# EAGLE design routedShield (EAGLE 8.7.1)
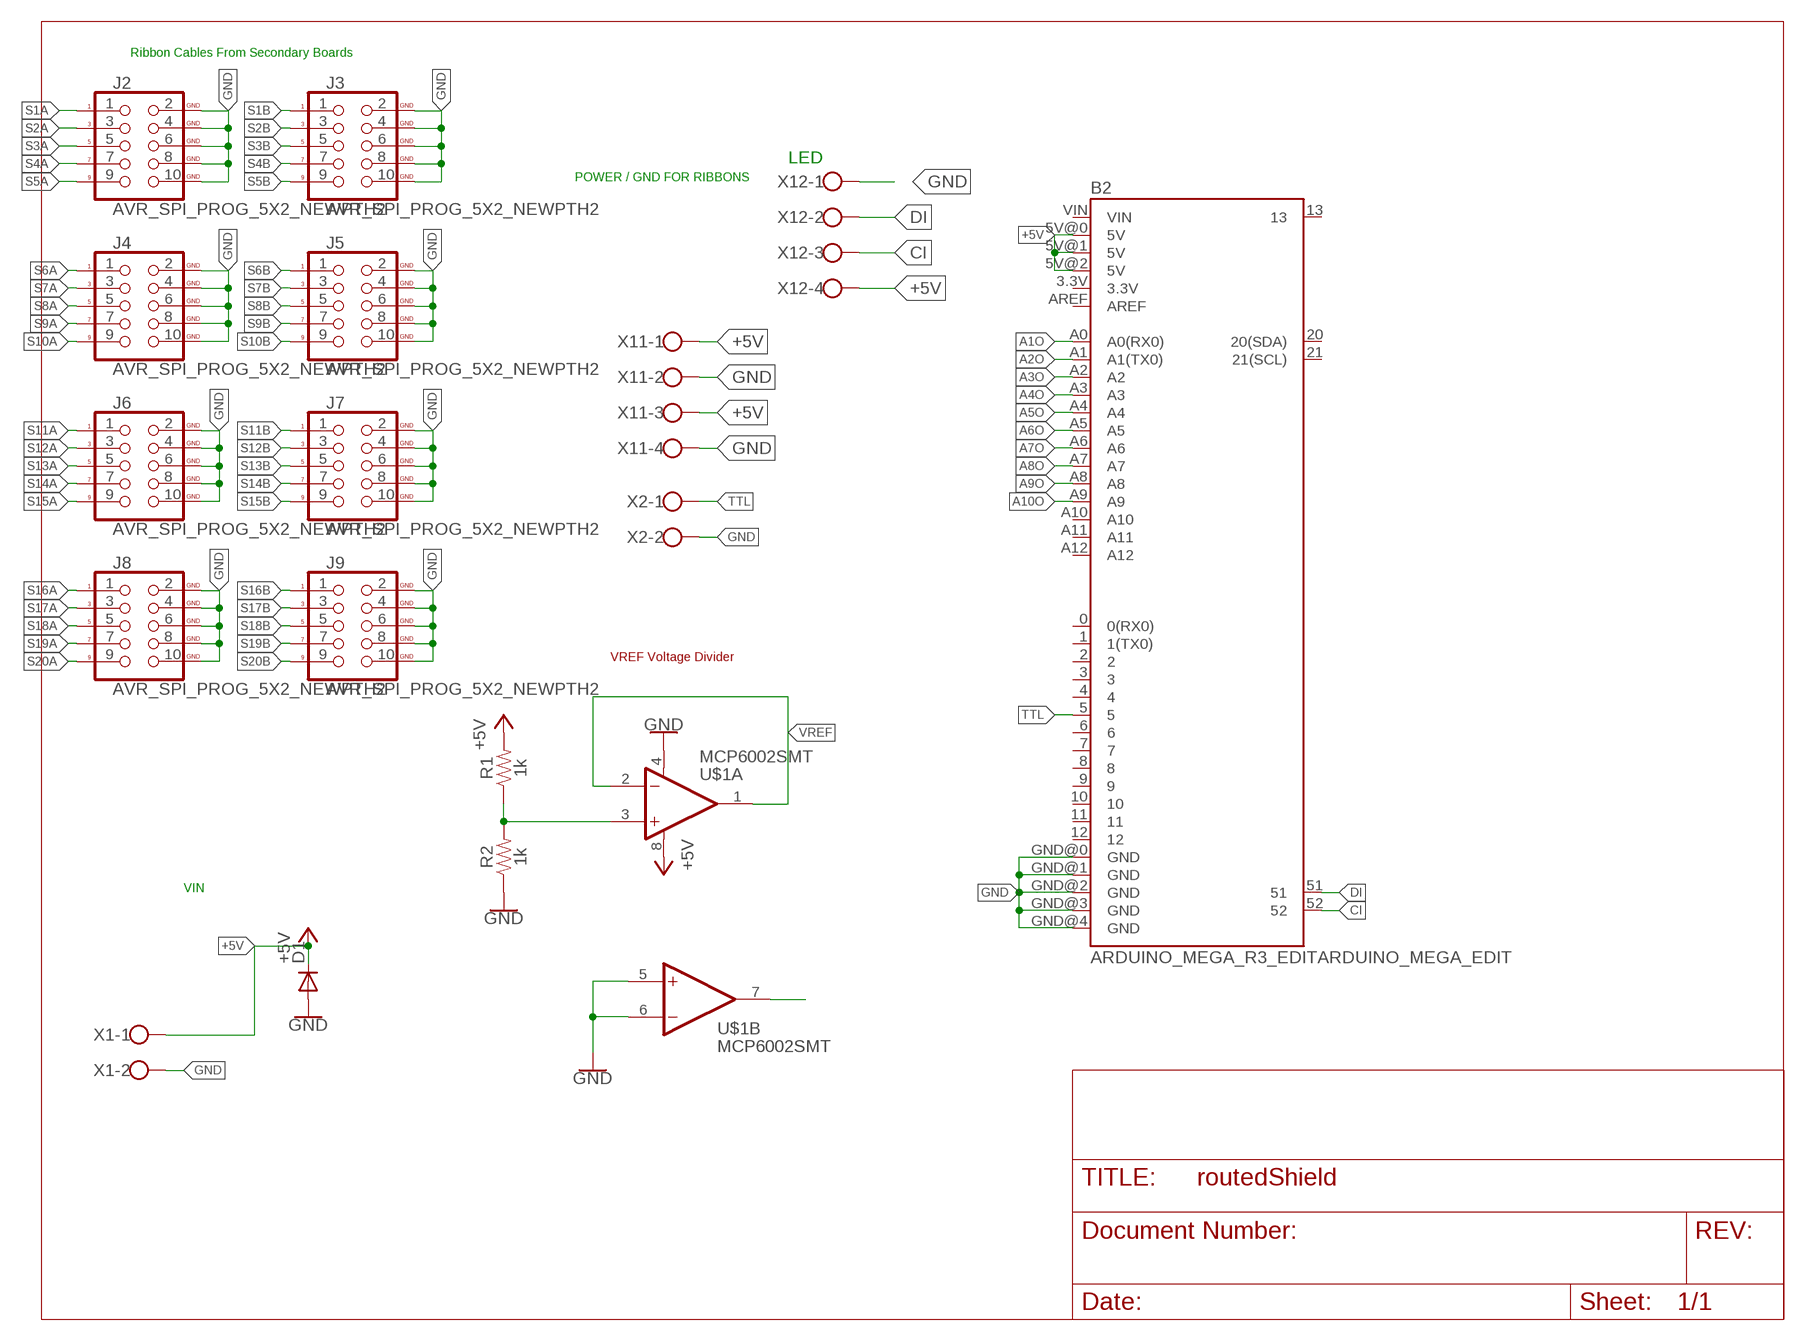
[diagram p0: schematic, sheet 1, part 1 of 2]
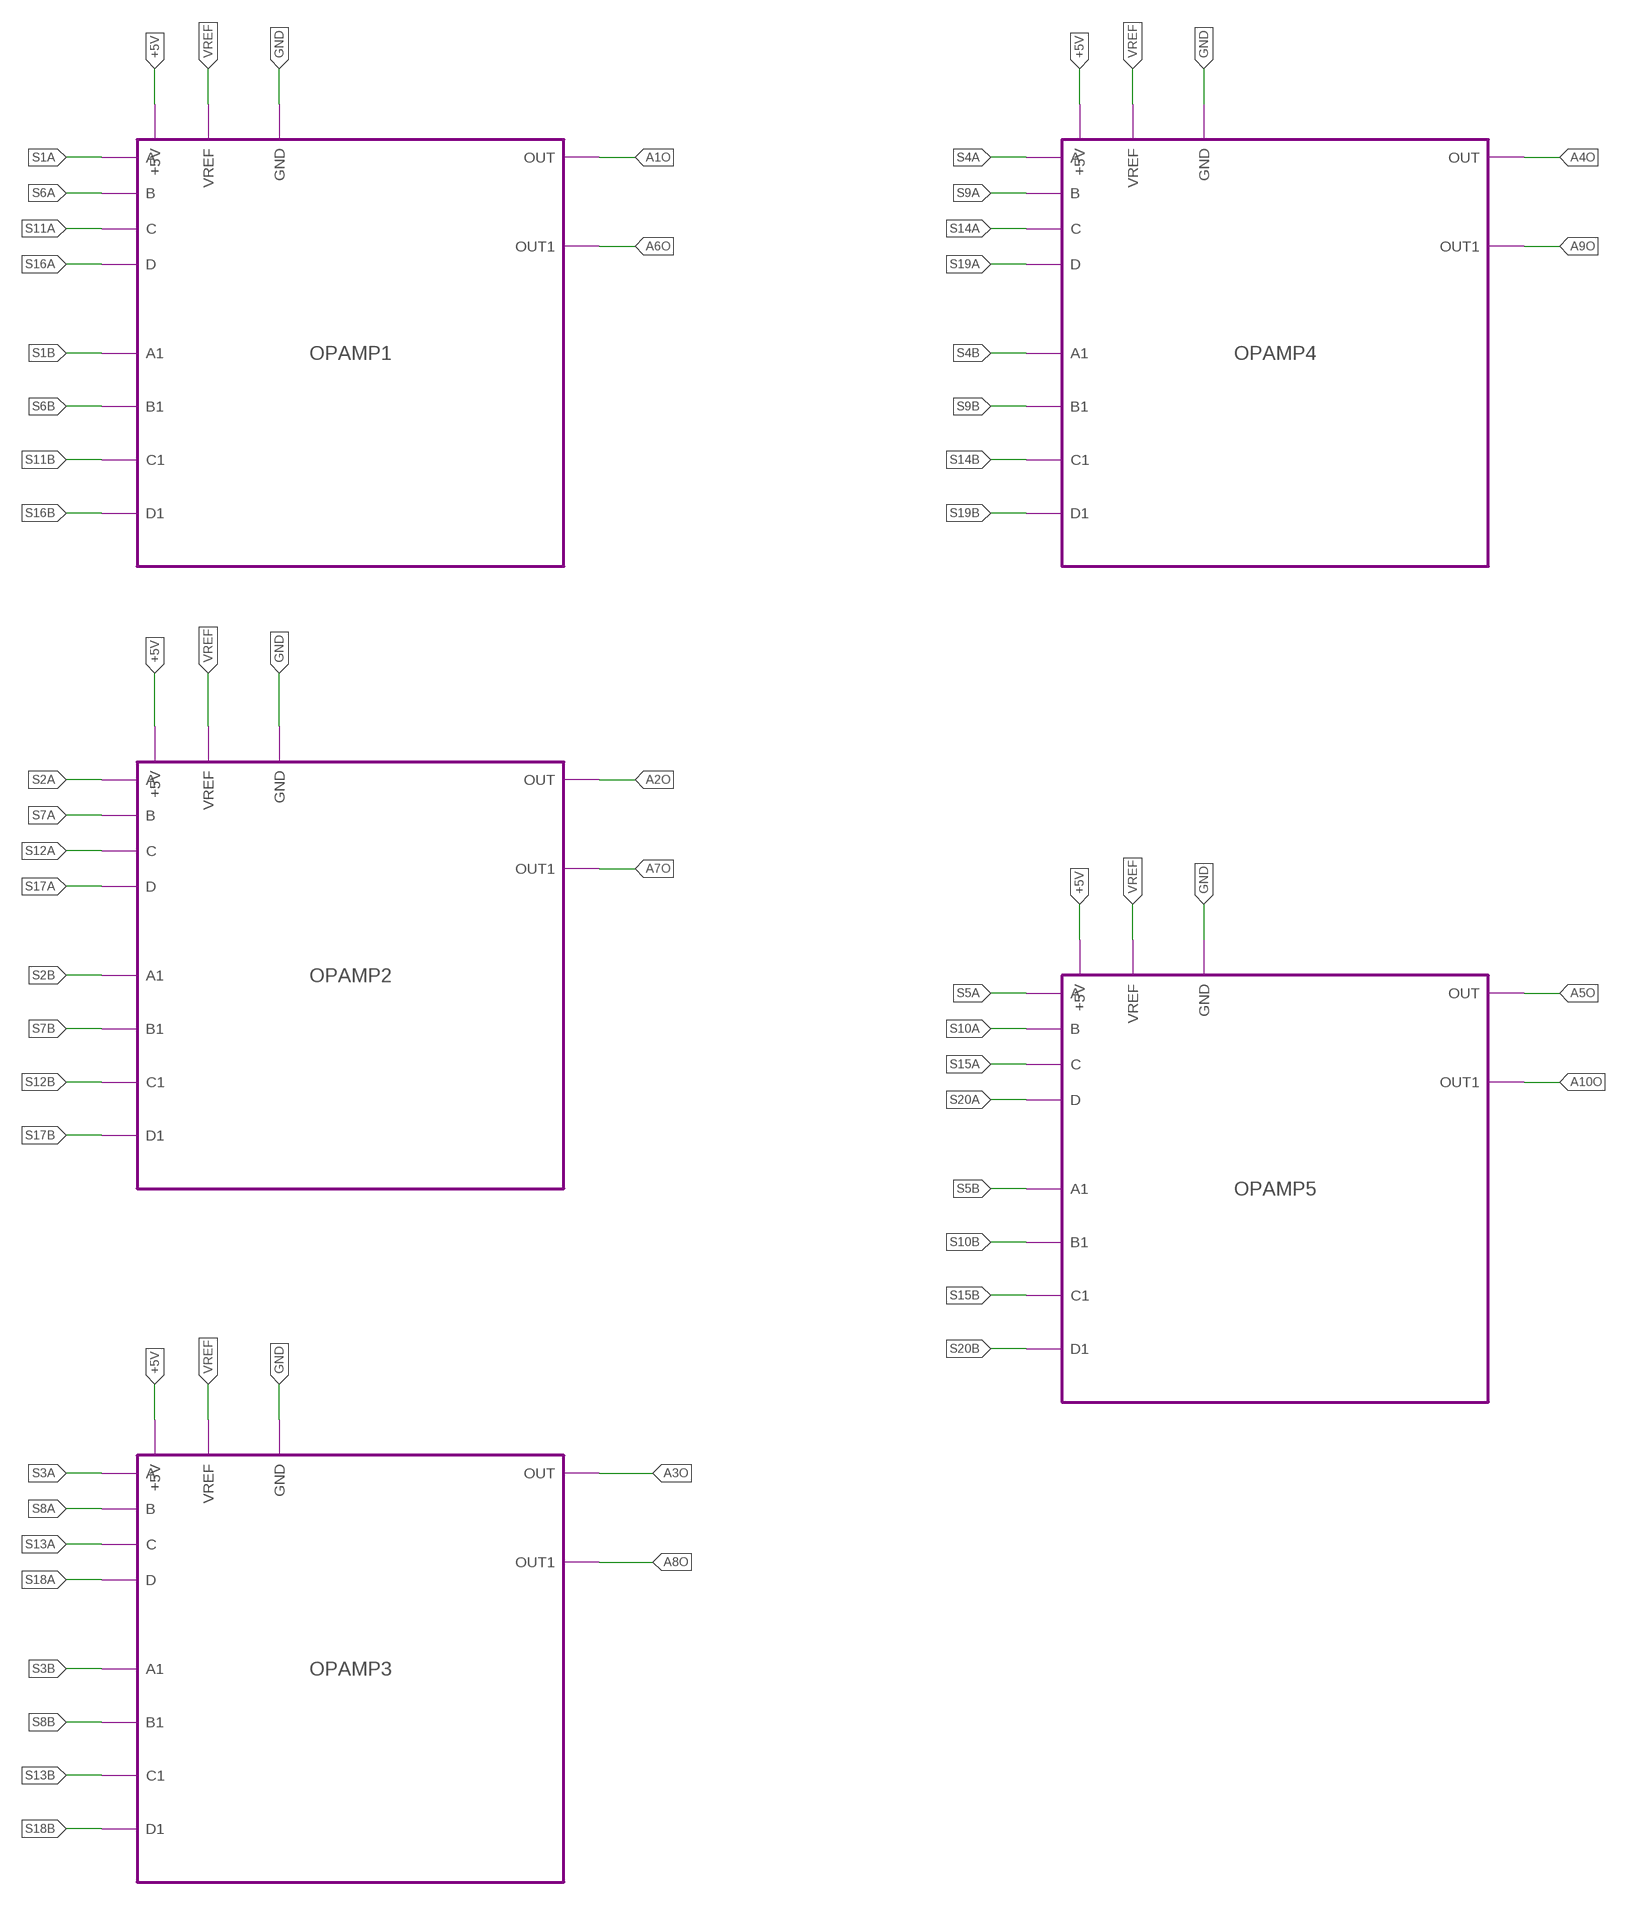
[diagram p1: schematic, sheet 1, part 2 of 2]

## Parts
B2  ARDUINO_MEGA_R3_EDITARDUINO_MEGA_EDIT  [ARDUINO_MEGA_EDIT]
D1  DIODE-DO-214AC  [DO-214AC]
J2  AVR_SPI_PROG_5X2_NEWPTH2  [2X5-SHROUDED]
J3  AVR_SPI_PROG_5X2_NEWPTH2  [2X5-SHROUDED]
J4  AVR_SPI_PROG_5X2_NEWPTH2  [2X5-SHROUDED]
J5  AVR_SPI_PROG_5X2_NEWPTH2  [2X5-SHROUDED]
J6  AVR_SPI_PROG_5X2_NEWPTH2  [2X5-SHROUDED]
J7  AVR_SPI_PROG_5X2_NEWPTH2  [2X5-SHROUDED]
J8  AVR_SPI_PROG_5X2_NEWPTH2  [2X5-SHROUDED]
J9  AVR_SPI_PROG_5X2_NEWPTH2  [2X5-SHROUDED]
R1  1k  RESISTOR0805  [0805]
R2  1k  RESISTOR0805  [0805]
U$1  MCP6002SMT  [SOIC8]
X1  W237-102  [W237-102]
X2  W237-102  [W237-102]
X11  W237-4  [W237-4]
X12  W237-4  [W237-4]

## Module instances
OPAMP1 = OPAMP
OPAMP2 = OPAMP
OPAMP3 = OPAMP
OPAMP4 = OPAMP
OPAMP5 = OPAMP

## Nets
+5V: B2.5V@0(5V) B2.5V@1(5V) B2.5V@2(5V) D1.C R1.2 U$1.8(A:V+) X1.1 X11.1 X11.3 X12.4 ; port OPAMP3.+5V OPAMP4.+5V OPAMP5.+5V OPAMP1.+5V OPAMP2.+5V
A1O: B2.A0(A0(RX0)) ; port OPAMP1.OUT
A2O: B2.A1(A1(TX0)) ; port OPAMP2.OUT
A3O: B2.A2 ; port OPAMP3.OUT
A4O: B2.A3 ; port OPAMP4.OUT
A5O: B2.A4 ; port OPAMP5.OUT
A6O: B2.A5 ; port OPAMP1.OUT1
A7O: B2.A6 ; port OPAMP2.OUT1
A8O: B2.A7 ; port OPAMP3.OUT1
A9O: B2.A8 ; port OPAMP4.OUT1
A10O: B2.A9 ; port OPAMP5.OUT1
CI: B2.52 X12.3
DI: B2.51 X12.2
GND: B2.GND@0(GND) B2.GND@1(GND) B2.GND@2(GND) B2.GND@3(GND) B2.GND@4(GND) D1.A J2.2(GND) J2.4(GND) J2.6(GND) J2.8(GND) J2.10(GND) J3.2(GND) J3.4(GND) J3.6(GND) J3.8(GND) J3.10(GND) J4.2(GND) J4.4(GND) J4.6(GND) J4.8(GND) J4.10(GND) J5.2(GND) J5.4(GND) J5.6(GND) J5.8(GND) J5.10(GND) J6.2(GND) J6.4(GND) J6.6(GND) J6.8(GND) J6.10(GND) J7.2(GND) J7.4(GND) J7.6(GND) J7.8(GND) J7.10(GND) J8.2(GND) J8.4(GND) J8.6(GND) J8.8(GND) J8.10(GND) J9.2(GND) J9.4(GND) J9.6(GND) J9.8(GND) J9.10(GND) R2.1 U$1.4(A:V-) U$1.5(B:+IN) U$1.6(B:-IN) X1.2 X2.2 X11.2 X11.4 X12.1 ; port OPAMP2.GND OPAMP3.GND OPAMP4.GND OPAMP5.GND OPAMP1.GND
N$1: U$1.7(B:OUT)
N$2: R1.1 R2.2 U$1.3(A:+IN)
S1A: J2.1 ; port OPAMP1.A
S1B: J3.1 ; port OPAMP1.A1
S2A: J2.3 ; port OPAMP2.A
S2B: J3.3 ; port OPAMP2.A1
S3A: J2.5 ; port OPAMP3.A
S3B: J3.5 ; port OPAMP3.A1
S4A: J2.7 ; port OPAMP4.A
S4B: J3.7 ; port OPAMP4.A1
S5A: J2.9 ; port OPAMP5.A
S5B: J3.9 ; port OPAMP5.A1
S6A: J4.1 ; port OPAMP1.B
S6B: J5.1 ; port OPAMP1.B1
S7A: J4.3 ; port OPAMP2.B
S7B: J5.3 ; port OPAMP2.B1
S8A: J4.5 ; port OPAMP3.B
S8B: J5.5 ; port OPAMP3.B1
S9A: J4.7 ; port OPAMP4.B
S9B: J5.7 ; port OPAMP4.B1
S10A: J4.9 ; port OPAMP5.B
S10B: J5.9 ; port OPAMP5.B1
S11A: J6.1 ; port OPAMP1.C
S11B: J7.1 ; port OPAMP1.C1
S12A: J6.3 ; port OPAMP2.C
S12B: J7.3 ; port OPAMP2.C1
S13A: J6.5 ; port OPAMP3.C
S13B: J7.5 ; port OPAMP3.C1
S14A: J6.7 ; port OPAMP4.C
S14B: J7.7 ; port OPAMP4.C1
S15A: J6.9 ; port OPAMP5.C
S15B: J7.9 ; port OPAMP5.C1
S16A: J8.1 ; port OPAMP1.D
S16B: J9.1 ; port OPAMP1.D1
S17A: J8.3 ; port OPAMP2.D
S17B: J9.3 ; port OPAMP2.D1
S18A: J8.5 ; port OPAMP3.D
S18B: J9.5 ; port OPAMP3.D1
S19A: J8.7 ; port OPAMP4.D
S19B: J9.7 ; port OPAMP4.D1
S20A: J8.9 ; port OPAMP5.D
S20B: J9.9 ; port OPAMP5.D1
TTL: B2.5 X2.1
VREF: U$1.1(A:OUT) U$1.2(A:-IN) ; port OPAMP2.VREF OPAMP3.VREF OPAMP4.VREF OPAMP5.VREF OPAMP1.VREF
Unconnected: B2.0(0(RX0)) B2.1(1(TX0)) B2.2 B2.3 B2.3.3V B2.4 B2.6 B2.7 B2.8 B2.9 B2.10 B2.11 B2.12 B2.13 B2.20(20(SDA)) B2.21(21(SCL)) B2.A10 B2.A11 B2.A12 B2.AREF B2.VIN

## Notes on the sheet
- Ribbon Cables From Secondary Boards
- LED
- POWER / GND FOR RIBBONS
- VREF Voltage Divider
- VIN

## Library data of the parts
B2 = SparkFun-Boards:ARDUINO_MEGA_R3_EDIT: Arduino Mega R3 ATmega2560 R3 compatible footprint. SparkFun Products: Arduino Mega 2560 R3 <https://www.sparkfun.com/products/11061>
D1 = diode:DIODE-: DIODE
J2-J9 = SparkFun-Connectors:AVR_SPI_PROG_5X2_NEW: AVR 10-pin ICSP Header This is the standard AVR In Circuit Serial Programming header. Minimal, but includes pin one indicator. Works with standard Olimex programmers. SparkFun Products: 2x5 AVR ICSP Male Header <https://www.sparkfun.com/products/778> - PTH 2x5 Pin Shrouded Header <https://www.sparkfun.com/products/8506> - PTH2; PROD_ID: CONN-08671; SF_ID: PRT-08506
R1 R2 = SparkFun-Resistors:RESISTOR: Generic Resistor Package
U$1 = adam - ics:MCP6002: Dual General Op Amp 1.8V min supply 1MHz (6V/us)
X1 X2 = con-wago-500:W237-102: WAGO SCREW CLAMP; MPN: 237-102; OC_FARNELL: unknown; OC_NEWARK: 70K9898
X11 X12 = con-wago-500:W237-4: WAGO SCREW CLAMP; OC_FARNELL: unknown; OC_NEWARK: unknown

## Module OPAMP
Ports: A(in) B(in) C(in) D(in) A1(in) B1(in) C1(in) D1(in) +5V(pwr) VREF(pwr) GND(pwr) OUT(out) OUT1(out)
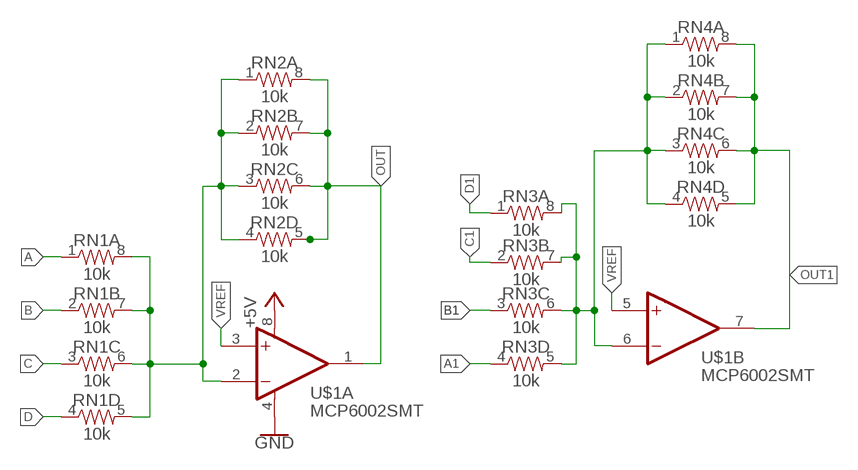
[diagram p2: schematic, module OPAMP, sheet 1]

### Parts
RN1  10k  1KOHM-ARRAY(4)0805-ARV-EDIT10K  [0805-ARV_EDIT10K]
RN2  10k  1KOHM-ARRAY(4)0805-ARV-EDIT10K  [0805-ARV_EDIT10K]
RN3  10k  1KOHM-ARRAY(4)0805-ARV-EDIT10K  [0805-ARV_EDIT10K]
RN4  10k  1KOHM-ARRAY(4)0805-ARV-EDIT10K  [0805-ARV_EDIT10K]
U$1  MCP6002SMT  [SOIC8]

### Nets
+5V: U$1.8(A:V+)
A: RN1.1
A1: RN3.4
B: RN1.2
B1: RN3.3
C: RN1.3
C1: RN3.2
D: RN1.4
D1: RN3.1
GND: U$1.4(A:V-)
N$1: RN3.5 RN3.6 RN3.7 RN3.8 RN4.1 RN4.2 RN4.3 RN4.4 U$1.6(B:-IN)
N$2: RN1.5 RN1.6 RN1.7 RN1.8 RN2.1 RN2.2 RN2.3 RN2.4 U$1.2(A:-IN)
OUT: RN2.5 RN2.6 RN2.7 RN2.8 U$1.1(A:OUT)
OUT1: RN4.5 RN4.6 RN4.7 RN4.8 U$1.7(B:OUT)
VREF: U$1.3(A:+IN) U$1.5(B:+IN)

### Library data of the parts
RN1-RN4 = SparkFun-Resistors:1KOHM-ARRAY(4): 4 x 1kΩ resistor array A resistor is a passive two-terminal electrical component that implements electrical resistance as a circuit element. Resistors act to reduce current flow, and, at the same time, act to lower voltage levels within circuits. - Wikipedia An array is a collection of discrete resistors in a single package.
U$1 = adam - ics:MCP6002: Dual General Op Amp 1.8V min supply 1MHz (6V/us)

## Net classes
0 default: width 0.203 mm, drill 0.381 mm, clearance 0.203 mm

## Board
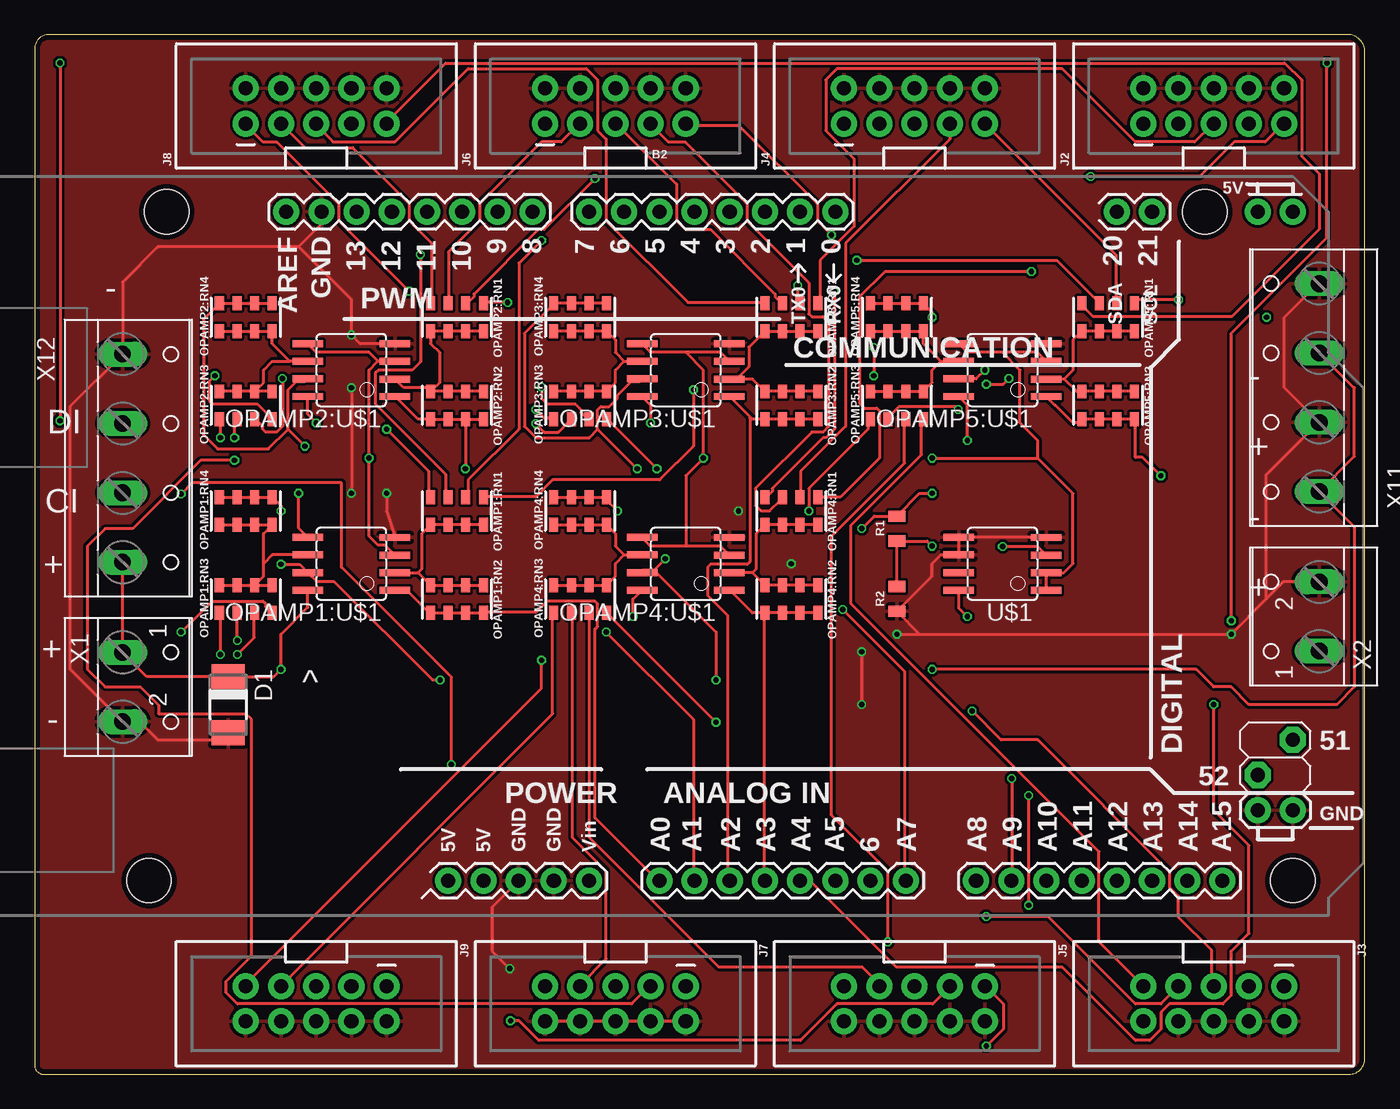
[diagram p3: board, top side]
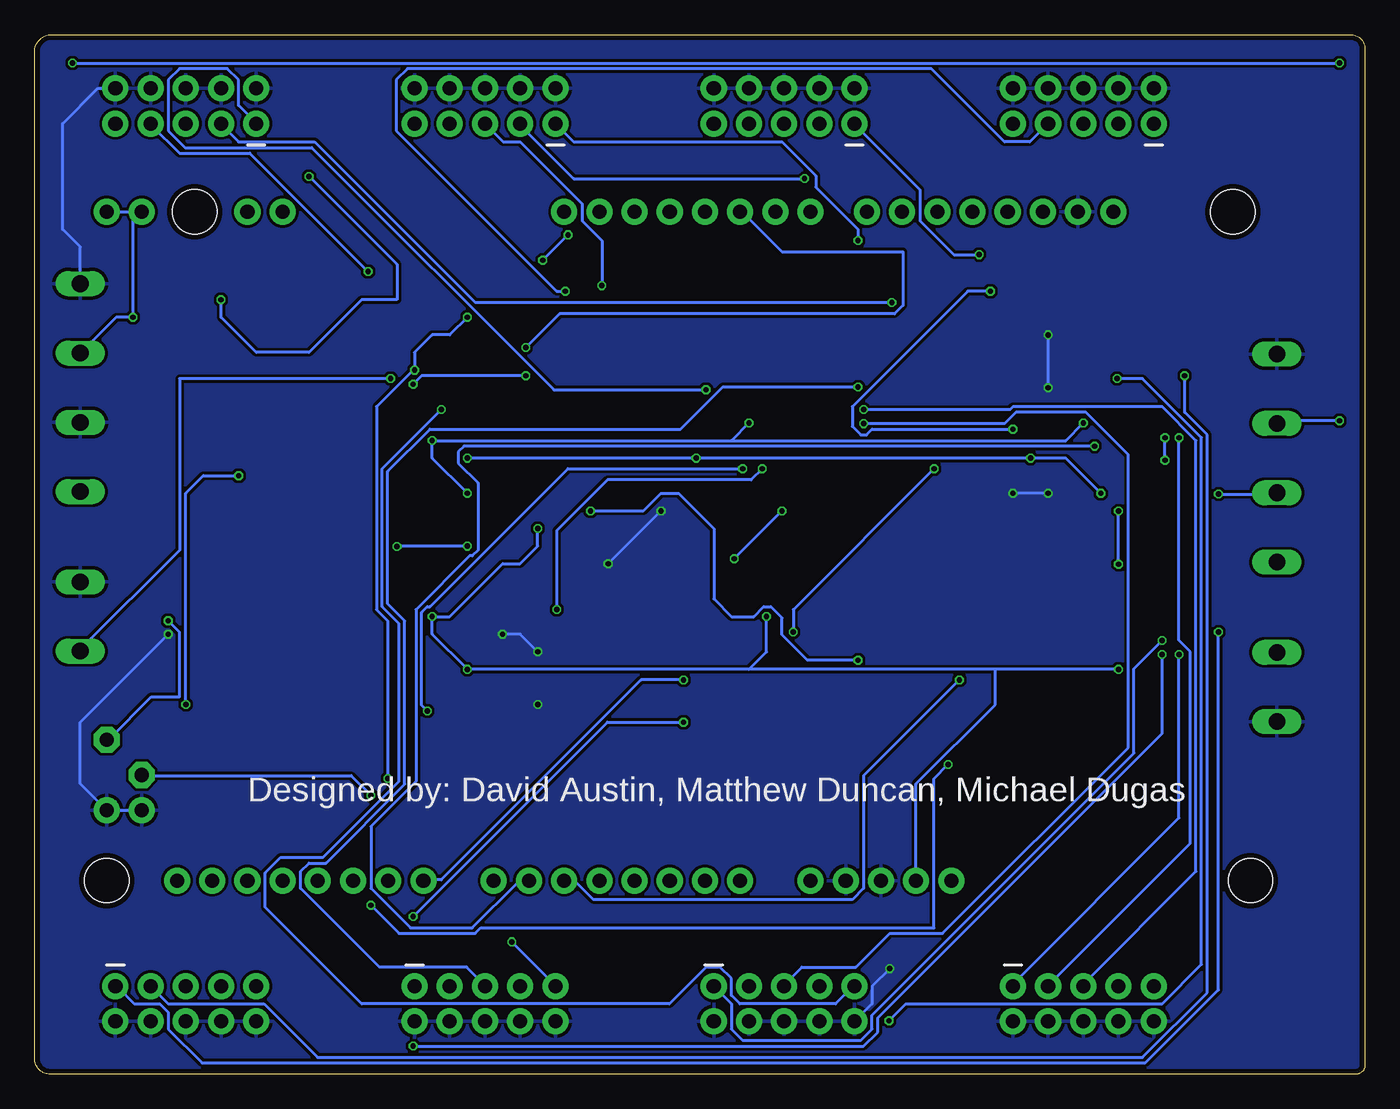
[diagram p4: board, bottom side, seen from below]

Size 96 x 75 mm. Coordinates in mm from the lower left corner, seen from the top.
Outline: 0,74 0,0.64 arc90 0.64,0 94.87,0 arc90 96,1.13 96,73.78 arc90 94.78,75 1,75 arc90 0,74
Copper layers (1*16): Top 0.035559375mm / dielectric 1.6mm / Bottom 0.035559375mm
Design rules "oshpark-2layer": minimum track width 6mil, minimum drill 10mil, track to track 6mil, track to pad 6mil, pad to pad 6mil, via to via 6mil, smd to smd 6mil, copper to edge 15mil, drill to drill 6mil, minimum pad ring 5mil, minimum via ring 5mil, stop-mask expansion 2.5mil, vias tented up to drill 0mil, thermal gap 10mil

### Footprints (pad centres in the part's own frame; a part is rotated, then mirrored left to right if it is on the bottom)
ARDUINO_MEGA_EDIT = drill 1.016 pad 1.88: 0 13.97,24.13; 1 11.43,24.13; 2 8.89,24.13; 3 6.35,24.13; 3.3V -13.97,-24.13; 4 3.81,24.13; 5 1.27,24.13; 5V@0 -11.43,-24.13; 5V@1 44.45,24.13; 5V@2 46.99,24.13; 6 -1.27,24.13; 7 -3.81,24.13; 8 -7.874,24.13; 9 -10.414,24.13; 10 -12.954,24.13; 11 -15.494,24.13; 12 -18.034,24.13; 13 -20.574,24.13; 20 34.29,24.13; 21 36.83,24.13; A0 1.27,-24.13; A1 3.81,-24.13; A2 6.35,-24.13; A3 8.89,-24.13; A4 11.43,-24.13; A5 13.97,-24.13; A6 16.51,-24.13; A7 19.05,-24.13; A8 24.13,-24.13; A9 26.67,-24.13; A10 29.21,-24.13; A11 31.75,-24.13; A12 34.29,-24.13; A13 36.83,-24.13; A14 39.37,-24.13; A15 41.91,-24.13; AREF -25.654,24.13; GND@0 -8.89,-24.13; GND@1 -6.35,-24.13; GND@2 44.45,-19.05; GND@3 46.99,-19.05; GND@4 -23.114,24.13; VIN -3.81,-24.13 | drill 1.016 pad 1.88 octagon: 51 46.99,-13.97; 52 44.45,-16.51 | hole 3.2: -34.29,24.13; -35.56,-24.13; 40.64,24.13; 46.99,-24.13
DO-214AC = smd 1.8 x 2.4: A 2.025,0; C -2.025,0
2X5-SHROUDED = drill 1.016 pad 1.88: 1 -1.27,5.08; 2 1.27,5.08; 3 -1.27,2.54; 4 1.27,2.54; 5 -1.27,0; 6 1.27,0; 7 -1.27,-2.54; 8 1.27,-2.54; 9 -1.27,-5.08; 10 1.27,-5.08
0805-ARV_EDIT10K = smd 0.65 x 1: 1 -1.905,-1; 2 -0.635,-1; 3 0.635,-1; 4 1.905,-1; 5 1.905,1; 6 0.635,1; 7 -0.635,1; 8 -1.905,1
SOIC8 = smd 0.5 x 2.2: 1 -1.905,-3.154; 2 -0.645,-3.154; 3 0.625,-3.154; 4 1.895,-3.154; 5 1.905,3.154; 6 0.635,3.154; 7 -0.635,3.154; 8 -1.905,3.154
0805 = smd 0.8 x 1.2: 1 -0.9,0; 2 0.9,0
W237-102 = drill 1.194 long: 1 -2.5,-1.27; 2 2.5,-1.27
W237-4 = drill 1.194 long: 1 -7.5,-1.27; 2 -2.5,-1.27; 3 2.5,-1.27; 4 7.5,-1.27

### Placement (x,y rotation side)
B2  43.81,38.1 0 top
D1  13.97,26.67 270 top
J2  85.09,69.85 90 top
J3  85.09,5.08 270 top
J4  63.5,69.85 90 top
J5  63.5,5.08 270 top
J6  41.91,69.85 90 top
J7  41.91,5.08 270 top
J8  20.32,69.85 90 top
J9  20.32,5.08 270 top
OPAMP1:RN1  10k  [0805-ARV_EDIT10K]  30.48,40.64 180 top
OPAMP1:RN2  10k  [0805-ARV_EDIT10K]  30.48,34.29 180 top
OPAMP1:RN3  10k  [0805-ARV_EDIT10K]  15.24,34.29 0 top
OPAMP1:RN4  10k  [0805-ARV_EDIT10K]  15.24,40.64 0 top
OPAMP1:U$1  MCP6002SMT  [SOIC8]  22.86,36.83 90 top
OPAMP2:RN1  10k  [0805-ARV_EDIT10K]  30.48,54.61 180 top
OPAMP2:RN2  10k  [0805-ARV_EDIT10K]  30.48,48.26 180 top
OPAMP2:RN3  10k  [0805-ARV_EDIT10K]  15.24,48.26 0 top
OPAMP2:RN4  10k  [0805-ARV_EDIT10K]  15.24,54.61 0 top
OPAMP2:U$1  MCP6002SMT  [SOIC8]  22.86,50.8 90 top
OPAMP3:RN1  10k  [0805-ARV_EDIT10K]  54.61,54.61 180 top
OPAMP3:RN2  10k  [0805-ARV_EDIT10K]  54.61,48.26 180 top
OPAMP3:RN3  10k  [0805-ARV_EDIT10K]  39.37,48.26 0 top
OPAMP3:RN4  10k  [0805-ARV_EDIT10K]  39.37,54.61 0 top
OPAMP3:U$1  MCP6002SMT  [SOIC8]  46.99,50.8 90 top
OPAMP4:RN1  10k  [0805-ARV_EDIT10K]  54.61,40.64 180 top
OPAMP4:RN2  10k  [0805-ARV_EDIT10K]  54.61,34.29 180 top
OPAMP4:RN3  10k  [0805-ARV_EDIT10K]  39.37,34.29 0 top
OPAMP4:RN4  10k  [0805-ARV_EDIT10K]  39.37,40.64 0 top
OPAMP4:U$1  MCP6002SMT  [SOIC8]  46.99,36.83 90 top
OPAMP5:RN1  10k  [0805-ARV_EDIT10K]  77.47,54.61 180 top
OPAMP5:RN2  10k  [0805-ARV_EDIT10K]  77.47,48.26 180 top
OPAMP5:RN3  10k  [0805-ARV_EDIT10K]  62.23,48.26 0 top
OPAMP5:RN4  10k  [0805-ARV_EDIT10K]  62.23,54.61 0 top
OPAMP5:U$1  MCP6002SMT  [SOIC8]  69.85,50.8 90 top
R1  62.23,39.37 90 top
R2  62.23,34.29 90 top
U$1  69.85,36.83 90 top
X1  7.62,27.94 270 top
X2  91.44,33.02 90 top
X11  91.44,49.53 90 top
X12  7.62,44.45 270 top

### Tracks (layer width: path | path; a pad name or v marks a point on that pad's centre or on a via)
+5V  (via drill 0.38)
  Top 0.203: X12.4 X1.1 8.1,28.7 D1.C 17.27,28.7 v17.78,29.21 17.78,31.75 19.71,33.68 OPAMP1:U$1.8 | v67.31,33.02 66.7,33.63 U$1.8 | v59.69,39.37 60.59,40.27 R1.2 63.87,41.91 v64.77,41.91 | OPAMP2:U$1.8 19.71,47.6 v20.32,46.99 | v67.31,45.72 67.31,48.28 OPAMP5:U$1.8 | OPAMP3:U$1.8 44.45,48.28 v44.45,46.99 | v43.18,33.02 43.18,34.27 OPAMP4:U$1.8 | X11.3 95.21,49.53 95.25,49.53 95.25,44.57 X11.1 95.25,39.49 95.25,27.94 93.98,26.67 87.63,26.67 86.36,27.94 85.09,27.94 83.82,29.21 v64.77,29.21
  Bottom 0.203: v17.78,29.21 26.67,29.21 | 26.67,29.21 44.45,29.21 | 44.45,29.21 v64.77,29.21 67.31,31.75 v67.31,33.02 66.04,33.02 62.23,36.83 60.96,36.83 59.69,38.1 v59.69,39.37 | v64.77,41.91 67.31,44.45 v67.31,45.72 45.72,45.72 | 45.72,45.72 21.59,45.72 v20.32,46.99 | v44.45,46.99 45.72,45.72 | 44.45,29.21 43.18,30.48 v43.18,33.02 | B2.5V@0 32.38,20.95 26.67,26.67 26.67,29.21 | B2.5V@2 B2.5V@1 88.9,61.59 v88.9,54.61 90.13,54.61 X11.3
A1O
  Top 0.203: B2.A0 44.91,14.02 40.44,18.49 40.44,32.11 40.64,32.31 40.64,33.93 40.44,34.14 36.98,34.14 36.17,33.33 32.51,33.33 OPAMP1:RN2.8 OPAMP1:RN2.7 OPAMP1:RN2.6 OPAMP1:RN2.5 28.45,33.33 26.85,34.92 OPAMP1:U$1.1
A2O  (via drill 0.38)
  Top 0.203: OPAMP2:RN2.7 OPAMP2:RN2.6 OPAMP2:RN2.5 27.67,47.26 26.04,48.9 OPAMP2:U$1.1 | OPAMP2:RN2.7 OPAMP2:RN2.8 | v41.25,31.9 47.55,25.6 47.55,14.02 B2.A1 | v31.09,43.69 31.09,47.14 OPAMP2:RN2.7
  Bottom 0.203: v41.25,31.9 41.25,33.53 v31.09,43.69
A3O
  Top 0.203: OPAMP3:RN2.8 OPAMP3:RN2.7 OPAMP3:RN2.6 OPAMP3:RN2.5 51.8,47.26 51.66,47.4 | OPAMP3:U$1.1 50.16,48.9 51.66,47.4 | B2.A2 49.99,14.02 49.99,33.12 48.56,34.54 48.56,36.58 48.77,36.78 51.41,36.78 51.61,36.98 51.61,47.35 51.66,47.4
A4O
  Top 0.203: OPAMP4:RN2.8 OPAMP4:RN2.7 OPAMP4:RN2.6 OPAMP4:RN2.5 | OPAMP4:RN2.5 51.8,33.29 50.16,34.92 OPAMP4:U$1.1 | B2.A3 52.63,14.02 52.63,33.12 OPAMP4:RN2.5
A5O  (via drill 0.38)
  Top 0.203: OPAMP5:U$1.1 73.64,48.26 73.66,48.26 74.93,46.99 75.3,46.99 OPAMP5:RN2.5 OPAMP5:RN2.6 OPAMP5:RN2.7 OPAMP5:RN2.8 79.45,47.14 79.45,44.5 79.96,44.5 v81.28,43.18 | B2.A4 55.27,13.82 56.08,13.82 62.18,7.72 74.17,7.72 79.45,2.44 80.47,2.44 81.28,3.25 81.28,4.47 81.89,5.08 85.75,5.08 86.36,5.69 86.36,8.89 87.63,10.16 87.63,16.51 85.09,19.05 v85.09,26.67
  Bottom 0.203: v85.09,26.67 85.09,41.91 83.82,43.18 v81.28,43.18
A6O  (via drill 0.38)
  Top 0.203: OPAMP1:RN4.8 OPAMP1:RN4.7 OPAMP1:RN4.6 OPAMP1:RN4.5 17.78,41.01 v17.78,40.64 | v29.26,28.45 28.7,28.45 21.59,35.56 20.34,35.56 OPAMP1:U$1.7 19.11,36.79 v17.78,36.79
  Bottom 0.203: v29.26,28.45 36.17,21.54 36.17,13.41 36.98,12.6 55.68,12.6 56.9,13.82 57.71,13.82 B2.A5 | v17.78,36.79 v17.78,40.64
A7O  (via drill 0.38)
  Top 0.203: OPAMP2:RN4.5 OPAMP2:RN4.6 OPAMP2:RN4.7 OPAMP2:RN4.8 13.21,55.47 12.19,54.46 12.19,46.13 13.21,45.11 16.87,45.11 18.29,46.53 | 18.29,46.53 18.29,49.38 18.9,49.99 19.51,49.99 OPAMP2:U$1.7 | 18.29,46.53 v19.51,45.31
  Bottom 0.203: v19.51,45.31 65.02,45.31 65.43,44.91 65.43,44.09 64.01,42.67 64.01,37.8 64.41,37.39 64.62,37.39 68.48,33.53 68.48,21.13 71.73,17.88 71.73,13.41 68.89,10.57 64.41,10.57 61.16,13.82 60.35,13.82 B2.A6
A8O  (via drill 0.38)
  Top 0.203: OPAMP3:RN4.5 OPAMP3:RN4.6 OPAMP3:RN4.7 OPAMP3:RN4.8 37.39,55.47 35.36,53.44 35.36,46.74 36.17,45.92 40.03,45.92 40.64,46.53 | 40.64,46.53 40.64,47.95 40.84,48.16 41.45,48.16 42.06,48.77 42.06,48.97 43.08,49.99 43.69,49.99 OPAMP3:U$1.7 | v58.32,33.53 62.79,29.06 62.79,14.02 B2.A7 | 40.64,46.53 v43.48,43.69
  Bottom 0.203: v58.32,33.53 58.32,39.22 54.66,42.88 44.3,42.88 v43.48,43.69
A9O  (via drill 0.38)
  Top 0.203: OPAMP4:RN4.8 OPAMP4:RN4.7 OPAMP4:RN4.6 OPAMP4:RN4.5 41.25,41.45 v42.06,40.64 | 44.7,36.37 43.89,36.37 OPAMP4:U$1.7 44.7,36.37 | v45.52,37.19 44.7,36.37 | v49.17,28.45 49.17,31.9 44.7,36.37
  Bottom 0.203: v42.06,40.64 v45.52,37.19 | v49.17,28.45 52.22,28.45 66.65,14.02 67.87,14.02 B2.A8
A10O  (via drill 0.38)
  Top 0.203: OPAMP5:RN4.8 OPAMP5:RN4.7 OPAMP5:RN4.6 OPAMP5:RN4.5 64.77,54.98 v64.77,54.61 | v68.58,50.8 67.94,50.16 OPAMP5:U$1.7 | v70.51,21.34 70.51,14.02 B2.A9
  Bottom 0.203: v64.77,54.61 66.04,53.34 67.31,53.34 68.58,52.07 v68.58,50.8 68.68,50.8 71.32,48.16 71.32,33.53 70.51,32.72 v70.51,21.34
CI  (via drill 0.38)
  Top 0.203: v10.57,41.86 11.38,42.67 22.15,42.67 22.15,36.58 30.07,28.65 v30.07,22.35 | v71.73,20.12 v71.73,12.19
  Bottom 0.203: v10.57,41.86 6.5,41.86 X12.3 | v30.07,22.35 31.09,21.34 31.09,10.57 63.8,10.57 64.21,10.16 69.7,10.16 v71.73,12.19 | v71.73,20.12 73.15,21.54 88.19,21.54 B2.52
DI  (via drill 0.38)
  Top 0.203: v1.83,72.95 v1.83,47.14 | v93.27,72.95 93.27,60.35 86.36,53.44 v86.36,32.72
  Bottom 0.203: v1.83,47.14 6.3,47.14 X12.2 | v93.27,72.95 v1.83,72.95 | v86.36,32.72 85.55,31.9 85.55,27.23 87.58,27.23 90.63,24.18 B2.51
GND  (via drill 0.38)
  Top 0.203: D1.A 13.46,24.13 8.89,24.13 7.58,25.44 X1.2 2.54,29.25 2.54,48.14 X12.1 6.35,57.15 8.89,59.69 19.05,59.69 | B2.GND@4 20.7,61.34 19.05,59.69 | U$1.4 U$1.5 U$1.6 65.41,37.47 64.77,36.83 64.77,35.93 R2.1 63.87,31.75 | B2.GND@0 33.02,12.06 33.02,8.89 v34.29,7.62 | J7.2 J7.4 J7.6 J7.8 J7.10 | v59.69,26.67 v59.69,30.48 | v62.23,31.75 63.87,31.75 | OPAMP2:U$1.4 23.5,52.7 v22.86,53.34 22.86,55.88 19.05,59.69 | v22.86,49.53 v22.86,41.91 | v25.4,41.91 25.4,40.61 OPAMP1:U$1.4 | 63.87,31.75 v86.36,31.75 88.9,34.29 | X11.2 92.67,47.03 | 92.67,47.03 90.17,49.53 90.17,54.61 92.59,57.03 X11.4 | 92.67,47.03 88.9,43.26 88.9,34.29 | X2.2 90.13,35.52 88.9,34.29
  Bottom 0.203: B2.GND@3 B2.GND@2 | B2.GND@3 90.17,19.68 | v34.29,7.62 35.56,6.35 35.56,5.08 J7.10 | v59.69,30.48 60.96,31.75 v62.23,31.75 | v22.86,53.34 v22.86,49.53 | v22.86,41.91 v25.4,41.91 | v54.61,36.83 v50.8,40.64 | B2.GND@3 92.71,20.95 92.71,25.4 v86.36,31.75 | X11.4 92.71,59.69 93.98,60.96 93.98,68.58 91.44,71.12 J2.10
  pour Top: 0,82.55 99.06,82.55 99.06,-1.27 -4.45,-1.27 -4.45,82.55
  pour Bottom: -6.35,84.45 100.97,84.45 100.97,83.19 100.97,-4.45 -6.35,-4.45 -6.35,83.82
N$2  (via drill 0.38)
  Top 0.203: v64.77,38.1 64.4,38.47 R1.1 R2.2 | v69.85,38.08 72.38,38.08 U$1.3
  Bottom 0.203: v64.77,38.1 69.85,38.1 v69.85,38.08
OPAMP1:N$1
  Top 0.203: OPAMP1:RN4.1 OPAMP1:RN4.2 OPAMP1:RN4.3 OPAMP1:RN4.4 16.51,39.01 16.51,36.83 | OPAMP1:RN3.8 OPAMP1:RN3.7 OPAMP1:RN3.6 | OPAMP1:RN3.6 OPAMP1:RN3.5 | OPAMP1:RN3.6 16.51,35.92 16.51,36.83 | 16.51,36.83 17.14,37.47 OPAMP1:U$1.6
OPAMP1:N$2
  Top 0.203: OPAMP1:RN2.1 OPAMP1:RN2.2 OPAMP1:RN2.3 OPAMP1:RN2.4 27.68,36.19 | OPAMP1:RN1.8 OPAMP1:RN1.7 OPAMP1:RN1.6 OPAMP1:RN1.5 27.94,39.01 27.94,36.45 27.68,36.19 | OPAMP1:U$1.2 27.68,36.19
OPAMP2:N$1
  Top 0.203: OPAMP2:RN3.5 OPAMP2:RN3.6 | OPAMP2:RN3.6 OPAMP2:RN3.7 OPAMP2:RN3.8 | OPAMP2:RN4.1 OPAMP2:RN4.2 OPAMP2:RN4.3 OPAMP2:RN4.4 17.14,52.7 18.41,51.44 | OPAMP2:U$1.6 18.41,51.44 | OPAMP2:RN3.6 16.51,49.9 16.51,50.8 17.14,51.44 18.41,51.44
OPAMP2:N$2
  Top 0.203: OPAMP2:RN2.1 OPAMP2:RN2.2 OPAMP2:RN2.3 OPAMP2:RN2.4 | OPAMP2:RN2.4 28.3,49.53 26.64,49.53 OPAMP2:U$1.2 | OPAMP2:RN2.4 29.21,49.9 29.21,52.07 28.57,52.7 OPAMP2:RN1.5 OPAMP2:RN1.6 OPAMP2:RN1.7 OPAMP2:RN1.8
OPAMP3:N$1
  Top 0.203: OPAMP3:RN3.8 OPAMP3:RN3.7 OPAMP3:RN3.6 OPAMP3:RN3.5 41.91,49.9 41.91,50.8 42.55,51.44 | OPAMP3:RN4.1 OPAMP3:RN4.2 OPAMP3:RN4.3 OPAMP3:RN4.4 41.91,52.98 41.91,52.07 42.55,51.44 | 42.55,51.44 OPAMP3:U$1.6
OPAMP3:N$2
  Top 0.203: OPAMP3:RN1.8 OPAMP3:RN1.7 OPAMP3:RN1.6 OPAMP3:RN1.5 51.55,52.45 51.55,51.05 50.8,50.3 50.8,50.16 | OPAMP3:RN2.1 OPAMP3:RN2.2 OPAMP3:RN2.3 OPAMP3:RN2.4 51.81,50.16 50.8,50.16 | 50.8,50.16 OPAMP3:U$1.2
OPAMP4:N$1
  Top 0.203: OPAMP4:RN3.8 OPAMP4:RN3.7 OPAMP4:RN3.6 OPAMP4:RN3.5 41.91,35.92 41.91,36.83 42.55,37.47 | 42.55,37.47 OPAMP4:U$1.6 | OPAMP4:RN4.1 OPAMP4:RN4.2 OPAMP4:RN4.3 OPAMP4:RN4.4 41.91,39.01 41.91,38.1 42.55,37.47
OPAMP4:N$2
  Top 0.203: OPAMP4:RN2.1 OPAMP4:RN2.2 OPAMP4:RN2.3 OPAMP4:RN2.4 51.81,36.19 | 51.81,36.19 OPAMP4:U$1.2 | OPAMP4:RN1.8 OPAMP4:RN1.7 OPAMP4:RN1.6 OPAMP4:RN1.5 52.07,39.01 52.07,36.45 51.81,36.19
OPAMP5:N$1
  Top 0.203: OPAMP5:RN4.1 OPAMP5:RN4.2 OPAMP5:RN4.3 OPAMP5:RN4.4 64.14,52.7 65.41,51.44 | OPAMP5:RN3.8 OPAMP5:RN3.7 OPAMP5:RN3.6 OPAMP5:RN3.5 64.77,49.9 64.77,50.8 65.41,51.44 | 65.41,51.44 OPAMP5:U$1.6
OPAMP5:N$2
  Top 0.203: OPAMP5:RN2.1 OPAMP5:RN2.2 OPAMP5:RN2.3 OPAMP5:RN2.4 75.2,49.26 74.31,50.16 74.28,50.16 | 74.28,50.16 OPAMP5:U$1.2 | OPAMP5:RN1.8 OPAMP5:RN1.7 OPAMP5:RN1.6 OPAMP5:RN1.5 74.93,52.98 74.93,50.8 74.28,50.16
S1A  (via drill 0.38)
  Top 0.203: v47.55,49.38 47.55,45.31 45.11,42.88 37.39,42.88 36.17,41.66 32.51,41.66 OPAMP1:RN1.1
  Bottom 0.203: v47.55,49.38 58.52,49.38 76,66.85 85.14,66.85 86.36,68.07 86.36,71.73 85.55,72.54 82.09,72.54 81.28,71.73 81.28,69.9 80.06,68.68 J2.1
S1B  (via drill 0.38)
  Top 0.203: v10.57,31.9 12.8,34.14 16.46,34.14 16.66,33.93 16.66,33.73 17.07,33.33 OPAMP1:RN3.4
  Bottom 0.203: v10.57,31.9 10.57,6.1 15.85,0.81 83.92,0.81 86.36,3.25 86.36,4.47 86.97,5.08 88.8,5.08 90.02,6.3 J3.1
S2A  (via drill 0.38)
  Top 0.203: v34.14,55.68 32.51,55.68 OPAMP2:RN1.1
  Bottom 0.203: v34.14,55.68 64.21,55.68 75.79,67.26 81.28,67.26 82.5,68.48 J2.3
S2B  (via drill 0.38)
  Top 0.203: v13.01,50.39 12.6,49.99 12.6,48.56 12.8,48.36 16.05,48.36 17.07,47.35 OPAMP2:RN3.4
  Bottom 0.203: v13.01,50.39 13.01,47.75 11.38,46.13 11.38,5.89 16.05,1.22 75.59,1.22 79.45,5.08 86.36,5.08 J3.3
S3A
  Top 0.203: OPAMP3:RN1.1 56.69,55.68 56.69,58.73 59.13,61.16 59.13,66.04 57.1,68.07 57.1,71.73 57.91,72.54 74.17,72.54 79.45,67.26 83.72,67.26 84.94,68.48 J2.5
S3B  (via drill 0.38)
  Top 0.203: v44.91,43.69 41.45,47.14 OPAMP3:RN3.4 | J3.5 84.94,6.5 84.94,8.94 82.55,11.33 82.55,12.85 81.94,13.45 81.94,14.58 72.39,24.13 69.75,24.13 v67.67,26.21
  Bottom 0.203: v44.91,43.69 57.51,43.69 67.46,33.73 67.67,33.73 68.07,33.33 68.07,26.62 v67.67,26.21
S4A  (via drill 0.38)
  Top 0.203: v71.93,57.91 61.37,57.91 59.54,56.08 59.54,48.41 59.88,48.06 60.78,48.06 60.96,47.88 60.96,44.45 58.15,41.64 OPAMP4:RN1.1 56.69,41.66
  Bottom 0.203: v71.93,57.91 80.47,66.45 85.55,66.45 87.58,68.48 J2.7
S4B  (via drill 0.38)
  Top 0.203: v49.17,25.4 41.45,33.12 OPAMP4:RN3.4 | v68.68,11.38 73.15,11.38 79.45,5.08 81.28,5.08 J3.7
  Bottom 0.203: v49.17,25.4 54.66,25.4 v68.68,11.38
S5A  (via drill 0.38)
  Top 0.203: OPAMP5:RN1.1 79.45,55.68 79.65,55.88 v82.55,55.88 | J2.9 90.02,68.48 88.8,67.26 86.56,67.26 84.07,64.77 v76.2,64.77
  Bottom 0.203: v82.55,55.88 82.55,54.61 80.01,52.07 76.2,52.07 72.39,55.88 69.85,55.88 69.85,58.42 v76.2,64.77
S5B
  Top 0.203: J3.9 76.81,9.55 76.81,16.05 58.93,33.93 58.93,39.62 64.01,44.7 64.01,47.14 OPAMP5:RN3.4
S6A  (via drill 0.38)
  Top 0.203: v36.58,60.15 34.95,58.52 34.95,46.53 31.29,42.88 31.29,41.66 OPAMP1:RN1.2
  Bottom 0.203: v36.58,60.15 36.58,60.96 39.62,64.01 39.62,64.82 42.06,67.26 57.1,67.26 J4.1
S6B  (via drill 0.38)
  Top 0.203: v14.63,30.28 15.85,31.5 15.85,33.12 OPAMP1:RN3.3 | v68.68,2.03 69.9,3.25 69.9,5.08 68.68,6.3 J5.1
  Bottom 0.203: v14.63,30.28 14.63,24.59 35.15,4.06 35.15,3.05 36.17,2.03 v68.68,2.03
S7A  (via drill 0.38)
  Top 0.203: v40.44,64.62 36.78,60.96 36.37,60.96 31.7,56.29 31.7,56.08 31.29,55.68 OPAMP2:RN1.2
  Bottom 0.203: v40.44,64.62 57.1,64.62 60.96,68.48 J4.3
S7B  (via drill 0.38)
  Top 0.203: v17.88,50.19 17.88,46.74 17.48,46.33 16.66,46.33 16.46,46.53 16.46,46.74 16.05,47.14 OPAMP2:RN3.3 | v34.34,3.86 34.95,3.86 36.37,2.44 55.27,2.44 57.91,5.08 64.82,5.08 66.04,6.3 J5.3
  Bottom 0.203: v17.88,50.19 16.05,50.19 11.79,45.92 11.79,7.92 14.63,5.08 33.12,5.08 v34.34,3.86
S8A  (via drill 0.38)
  Top 0.203: v55.07,56.9 55.07,55.68 OPAMP3:RN1.2
  Bottom 0.203: v55.07,56.9 55.07,60.15 56.49,61.57 56.49,62.79 60.96,67.26 62.18,67.26 J4.5
S8B  (via drill 0.38)
  Top 0.203: v36.58,49.58 36.58,48.77 36.98,48.36 39.01,48.36 39.42,47.95 39.42,47.75 39.83,47.35 OPAMP3:RN3.3
  Bottom 0.203: v36.58,49.58 46.33,49.58 49.38,46.53 67.46,46.53 70.51,43.48 70.51,33.93 69.29,32.72 69.29,20.93 74.98,15.24 76.2,15.24 76.81,14.63 76.81,13.41 71.12,7.72 64.82,7.72 63.6,6.5 J5.5
S9A
  Top 0.203: J4.7 66.04,67.46 58.52,59.94 58.52,46.74 55.27,43.48 55.27,41.66 OPAMP4:RN1.2
S9B
  Top 0.203: OPAMP4:RN3.3 40.03,33.12 40.03,17.07 49.38,7.72 59.74,7.72 60.96,6.5 J5.7
S10A
  Top 0.203: J4.9 78.03,59.13 78.03,55.68 OPAMP5:RN1.2
S10B  (via drill 0.38)
  Top 0.203: v61.57,9.55 61.57,14.63 57.51,18.69 57.51,38.81 62.79,44.09 62.79,47.14 OPAMP5:RN3.3
  Bottom 0.203: v61.57,9.55 58.52,6.5 J5.9
S11A  (via drill 0.38)
  Top 0.203: v27.84,59.13 27.84,51.41 27.23,50.8 24.79,50.8 24.59,50.6 24.59,48.36 29.67,43.28 29.67,41.66 OPAMP1:RN1.3
  Bottom 0.203: v27.84,59.13 29.67,59.13 32.11,61.57 32.11,63.8 36.78,68.48 J6.1
S11B  (via drill 0.38)
  Top 0.203: v14.63,31.29 14.63,33.12 OPAMP1:RN3.2
  Bottom 0.203: v14.63,31.29 16.66,29.26 16.66,23.16 35.56,4.27 35.56,3.25 36.37,2.44 44.91,2.44 45.72,3.25 45.72,5.08 J7.1
S12A
  Top 0.203: OPAMP2:RN1.3 29.87,55.68 29.87,59.33 32.11,61.57 32.11,62.79 36.58,67.26 38,67.26 39.22,68.48 J6.3
S12B  (via drill 0.38)
  Top 0.203: v14.43,45.92 14.43,47.14 OPAMP2:RN3.2 | v14.43,44.3 11.99,44.3 7.06,39.37 5.08,39.37 3.81,38.1 3.81,29.21 5.08,27.94 7.62,27.94 8.94,26.62 8.94,26.01 15.24,26.01 15.65,25.6 15.65,8.53 13.82,6.71 13.82,5.89 14.63,5.08 43.08,5.08 44.3,6.3 J7.3
  Bottom 0.203: v14.43,44.3 v14.43,45.92
S13A
  Top 0.203: OPAMP3:RN1.3 53.85,55.68 53.44,56.08 53.44,56.29 48.77,60.96 46.94,60.96 46.33,61.57 46.33,64.21 42.06,68.48 J6.5
S13B  (via drill 0.38)
  Top 0.203: v36.17,46.94 36.78,46.33 37.8,46.33 38.61,47.14 OPAMP3:RN3.2
  Bottom 0.203: v36.17,46.94 26.01,46.94 25.2,47.75 20.12,47.75 17.07,44.7 17.07,23.57 30.48,10.16 34.29,10.16 36.73,7.72 40.64,7.72 41.86,6.5 J7.5
S14A
  Top 0.203: OPAMP4:RN1.3 53.85,41.45 53.03,40.64 52.43,40.64 52.02,41.05 52.02,42.27 56.08,46.33 56.9,46.33 57.3,46.74 57.3,54.25 56.9,54.66 56.08,54.66 55.88,54.86 55.88,57.1 51.41,61.57 51.41,62.79 46.94,67.26 45.72,67.26 44.5,68.48 J6.7
S14B
  Top 0.203: OPAMP4:RN3.2 38.81,33.12 38.81,17.07 41.25,14.63 41.25,8.33 39.42,6.5 J7.7
S15A  (via drill 0.38)
  Top 0.203: v59.33,58.73 73.76,58.73 76.81,55.68 OPAMP5:RN1.3 | v57.51,60.55 56.49,61.57 56.49,62.79 50.8,68.48 47.14,68.48 J6.9
  Bottom 0.203: v57.51,60.55 v59.33,58.73
S15B  (via drill 0.38)
  Top 0.203: v66.65,47.95 66.45,48.16 62.38,48.16 61.59,47.37 OPAMP5:RN3.2
  Bottom 0.203: v66.65,47.95 70.92,43.69 70.92,33.73 69.7,32.51 69.7,21.13 75.18,15.65 78.23,15.65 79.35,14.53 79.35,12.04 72.39,5.08 50.19,5.08 47.55,7.72 46.53,7.72 45.72,6.91 45.72,5.69 45.11,5.08 38.2,5.08 36.98,6.3 J7.9
S16A  (via drill 0.38)
  Top 0.203: v25.4,46.53 28.45,43.48 28.45,41.66 OPAMP1:RN1.4 | v27.03,56.49 21.95,61.57 21.95,62.79 17.48,67.26 16.46,67.26 15.24,68.48 J8.1
  Bottom 0.203: v25.4,46.53 35.56,46.53 35.97,46.13 36.37,46.13 36.98,46.74 36.98,48.16 28.65,56.49 v27.03,56.49
S16B  (via drill 0.38)
  Top 0.203: v13.41,30.28 13.41,33.12 OPAMP1:RN3.1
  Bottom 0.203: v13.41,30.28 13.41,18.49 25.4,6.5 J9.1
S17A
  Top 0.203: J8.3 19.51,66.85 22.96,66.85 27.03,62.79 27.03,61.57 28.65,59.94 28.65,55.68 OPAMP2:RN1.4
S17B  (via drill 0.38)
  Top 0.203: v13.41,45.92 13.41,47.14 OPAMP2:RN3.1
  Bottom 0.203: v13.41,45.92 13.41,31.29 12.6,30.48 12.6,16.66 22.76,6.5 J9.3
S18A
  Top 0.203: OPAMP3:RN1.4 52.63,55.68 47.14,55.68 41.25,61.57 41.25,67.46 40.64,68.07 40.64,71.73 39.83,72.54 31.29,72.54 26.01,67.26 21.54,67.26 20.32,68.48 J8.5
S18B  (via drill 0.38)
  Top 0.203: v36.17,47.95 36.78,47.35 37.39,47.35 OPAMP3:RN3.1
  Bottom 0.203: v36.17,47.95 25.6,47.95 25.4,48.16 14.63,48.16 12.19,45.72 12.19,14.63 20.32,6.5 J9.5
S19A  (via drill 0.38)
  Top 0.203: v57.71,56.49 57.71,46.53 57.1,45.92 56.9,45.92 53.24,42.27 53.24,42.06 52.83,41.66 OPAMP4:RN1.4
  Bottom 0.203: v57.71,56.49 58.32,56.49 69.9,68.07 69.9,71.73 69.09,72.54 31.29,72.54 26.01,67.26 24.18,67.26 J8.7
S19B
  Top 0.203: OPAMP4:RN3.1 37.39,33.12 37.39,26.01 17.88,6.5 J9.7
S20A
  Top 0.203: OPAMP5:RN1.4 75.59,55.47 76.4,54.66 86.41,54.66 92.71,60.96 92.71,64.97 91.44,66.24 91.44,71.73 90.22,72.95 29.67,72.95 25.4,68.68 J8.9
S20B  (via drill 0.38)
  Top 0.203: v55.88,40.64 55.88,42.27 60.15,46.53 60.15,47.08 OPAMP5:RN3.1 60.15,47.14 | v36.58,29.87 36.58,27.84 15.24,6.5 J9.9
  Bottom 0.203: v36.58,29.87 40.23,29.87 42.06,31.7 42.06,32.92 42.88,33.73 43.38,33.73 44.1,33.02 45.72,33.02 46.99,34.29 46.99,39.37 49.53,41.91 50.8,41.91 52.07,40.64 v55.88,40.64
TTL  (via drill 0.38)
  Top 0.203: v70.31,50.19 69.9,49.78 v68.68,49.78 | v60.55,52.43 v60.55,50.39
  Bottom 0.203: v70.31,50.19 85.55,50.19 85.55,37.8 92.66,30.68 X2.1 | v68.68,49.78 68.07,50.39 v60.55,50.39 | v60.55,52.43 58.12,54.86 33.93,54.86 33.33,55.47 33.33,59.33 42.06,59.33 44.91,62.18 B2.5
VREF  (via drill 0.38)
  Top 0.203: U$1.1 U$1.2 74.28,36.19 74.93,36.83 74.93,41.91 72.39,44.45 | v64.77,44.45 72.39,44.45 | 72.39,44.45 72.39,45.72 71.12,46.99 71.12,50.8 69.85,52.07 | OPAMP5:U$1.3 72.36,52.07 69.85,52.07 | OPAMP5:U$1.5 67.33,52.07 69.85,52.07 | OPAMP3:U$1.3 49.53,52.04 49.53,52.07 46.99,52.07 | 46.99,52.07 44.45,52.07 43.84,52.68 OPAMP3:U$1.5 | OPAMP2:U$1.3 24.77,51.42 | 24.77,51.42 24.13,52.07 20.32,52.07 19.71,52.68 OPAMP2:U$1.5 | OPAMP4:U$1.3 49.5,38.1 46.99,38.1 | OPAMP4:U$1.5 43.84,38.71 44.45,38.1 46.99,38.1 | 24.77,51.42 24.75,51.42 24.13,50.8 v24.13,44.45 24.13,38.83 24.79,38.17 25.3,38.17 OPAMP1:U$1.3 | 46.99,52.07 48.26,50.8 v48.26,44.45 46.99,43.18 46.99,38.1 | OPAMP1:U$1.5 19.05,39.39 v19.05,41.91
  Bottom 0.203: v19.05,41.91 21.59,44.45 v24.13,44.45 v48.26,44.45 v64.77,44.45

### Text on the board
tPlace: - | - | DI | + | CI | - | + | + | + | ^ | -
bPlace: Designed by: David Austin, Matthew Duncan, Michael Dugas